# Altium schematic sheet WC_KB.SchDoc
size A; Organization: Altium Limited; Address1: L3, 12a Rodborough Rd; Address2: Frenchs Forest; Address3: NSW; Address4: Australia 2086; DocumentNumber: 7; SheetNumber: 7; SheetTotal: 11
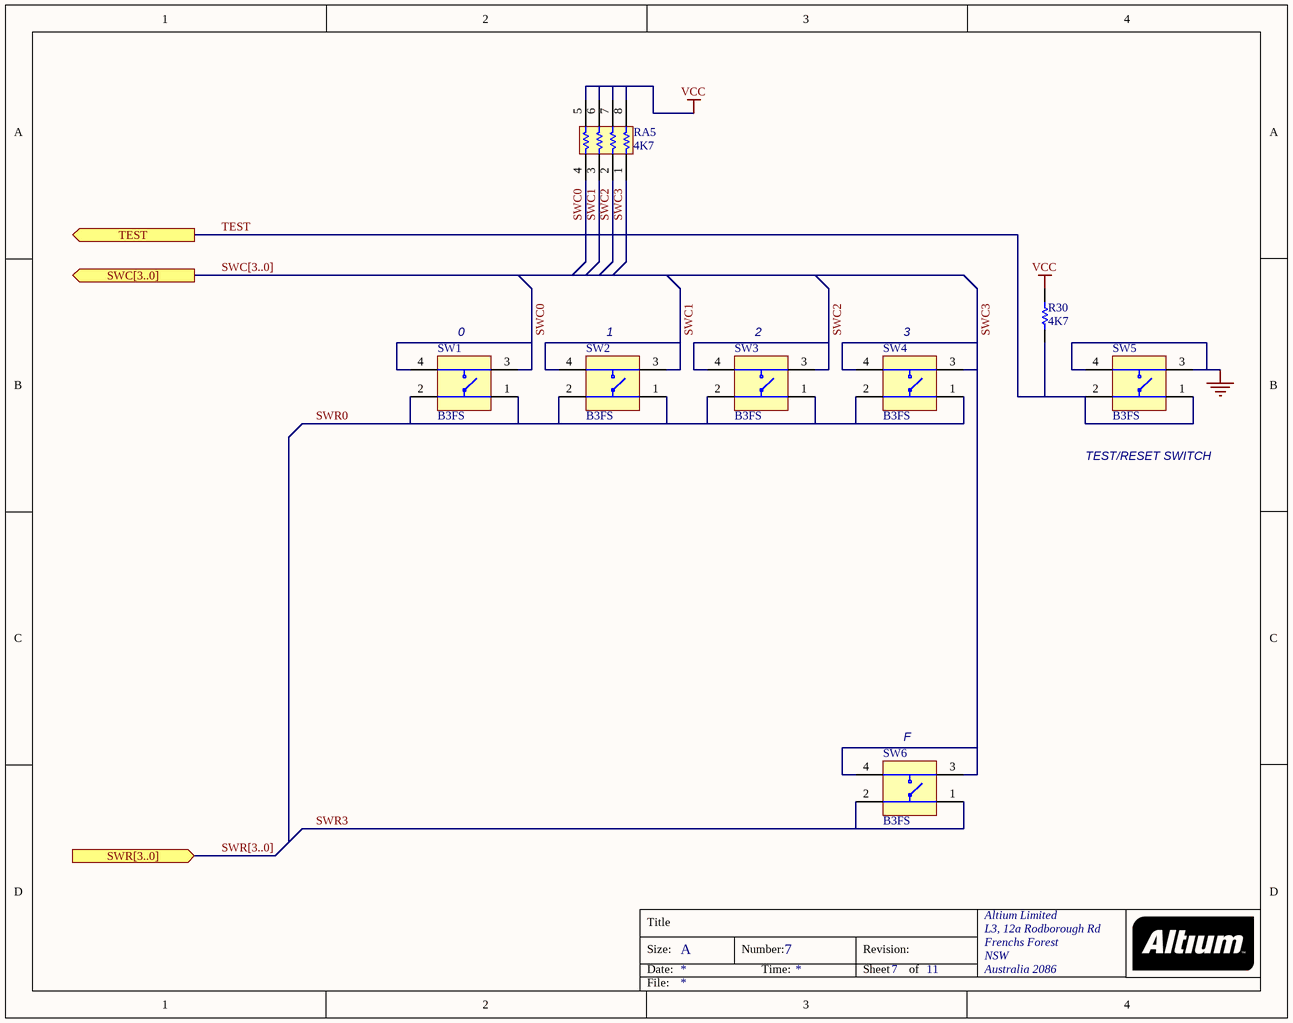
[diagram p0: WC_KB.SchDoc]

## Parts
R30  4K7  [CC2012-0805]
RA5  4K7  [MNR34]
SW1  B3FS  [B3FS_SWITCH]
SW2  B3FS  [B3FS_SWITCH]
SW3  B3FS  [B3FS_SWITCH]
SW4  B3FS  [B3FS_SWITCH]
SW5  B3FS  [B3FS_SWITCH]
SW6  B3FS  [B3FS_SWITCH]

## Ports
SWC[3..0] (out), SWR[3..0] (in), TEST (out)

## Nets
GND: SW5.3 SW5.4
VCC: R30.1 RA5.5 RA5.6 RA5.7 RA5.8
SWC0: RA5.4 SW1.3 SW1.4
SWC1: RA5.3 SW2.3 SW2.4
SWC2: RA5.2 SW3.3 SW3.4
SWC3: RA5.1 SW4.3 SW4.4 SW6.3 SW6.4
SWR0: SW1.1 SW1.2 SW2.1 SW2.2 SW3.1 SW3.2 SW4.1 SW4.2
SWR3: SW6.1 SW6.2
TEST: R30.2 SW5.1 SW5.2 ; port TEST

## Buses and harness runs
bus SWC[3..0] = port SWC[3..0]
bus SWR[3..0] = port SWR[3..0]

## Notes on the sheet
- (near SW1) 0
- (near SW2) 1
- (near SW3) 2
- (near SW4) 3
- TEST/RESET SWITCH
- (near SW6) F
- Title
- Size:
- Date:
- A
- Number:
- Time:
- Revision:
- Sheet
- of
- File:

## Library data of the parts
R30 = RES: Resistor
RA5 = MNR34: 3216x4 Resistor Array
SW1-SW6 = B3FS: SPNA SMD Keyboard Switch
  SW1: Comment_1: B3FS